# Altium schematic sheet HightKey.SchDoc
size A4
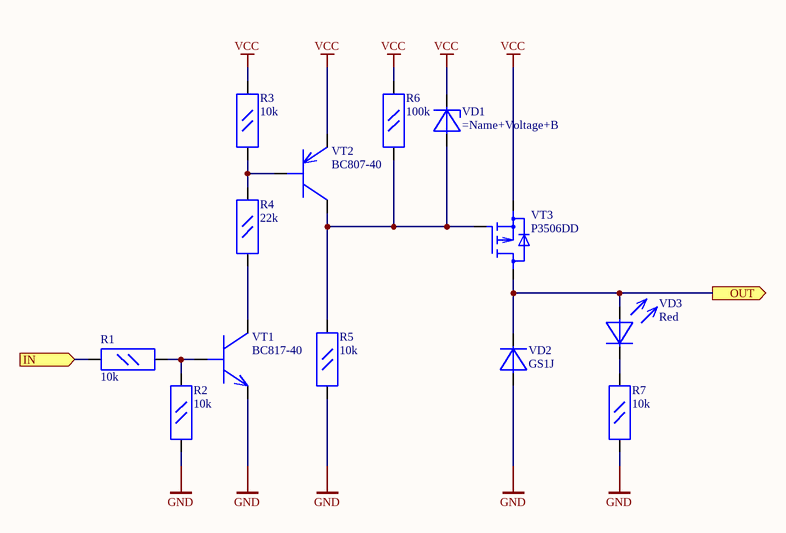
[diagram p0: HightKey.SchDoc]

## Parts
R1  Resistance (Ohms): 10k  [RES0805]  (hidden comment: R0805)
R2  Resistance (Ohms): 10k  [RES0805]  (hidden comment: R0805)
R3  Resistance (Ohms): 10k  [RES0805]  (hidden comment: R0805)
R4  Resistance (Ohms): 22k  [RES0805]  (hidden comment: R0805)
R5  Resistance (Ohms): 10k  [RES0805]  (hidden comment: R0805)
R6  Resistance (Ohms): 100k  [RES0805]  (hidden comment: R0805)
R7  Resistance (Ohms): 10k  [RES0805]  (hidden comment: R0805)
VD1  (no value)  [SOD323]
VD2  GS1J  [DO-214AC(SMA)]
VD3  Color: Red  [3mm led red]  (hidden comment: Led Red 3mm)
VT1  BC817-40  [SOT95P230X110-3N]
VT2  BC807-40  [SOT95P230X110-3N]
VT3  P3506DD  [DPAK]

## Ports
IN (in), OUT (out)

## Nets
GND: R2.1 R5.1 R7.1 VD2.2(A) VT1.2(E)
VCC: R3.2 R6.2 VD1.1(C) VT2.2(E) VT3.3(S)
IN: R1.1 ; port IN
OUT: VD2.1(C) VD3.2(A) VT3.2(D) ; port OUT
NetR1_2: R1.2 R2.2 VT1.1(B)
NetR3_1: R3.1 R4.2 VT2.1(B)
NetR4_1: R4.1 VT1.3(C)
NetR5_2: R5.2 R6.1 VD1.2(A) VT2.3(C) VT3.1(G)
NetR7_2: R7.2 VD3.1(C)

## Library data of the parts
R1-R7 = R0805: Resistor; Power (Watts): 1/8W; Package: 0805; Category: Resistors
VD1 = PDZ-B: Diode; Name: PDZ; Voltage: 12; Package: SOD323
VD2 = GS1J: 1.0A Surface Mount Standard Diode; Manufacturer: WTE; Voltage: 600V; Name: GS1J; Package: SMA(DO-214AC)
VD3 = Led Red 3mm: 3mm Red Led 2.54pitch
VT1 = BC817-40: NPN bipolar transistor; Package: SOT23; Name: BC817-40
VT2 = BC807-40: PNP bipolar transistor; Package: SOT23; Name: BC807-40
VT3 = P3506DD: P-channel MOSFET transistor; Manufacturer: NIKO SEMICONDUCTOR CO; Package: D-PAK(TO-252); Name: P3506DD